# EAGLE design footwell_tiny (EAGLE 9.6.0)
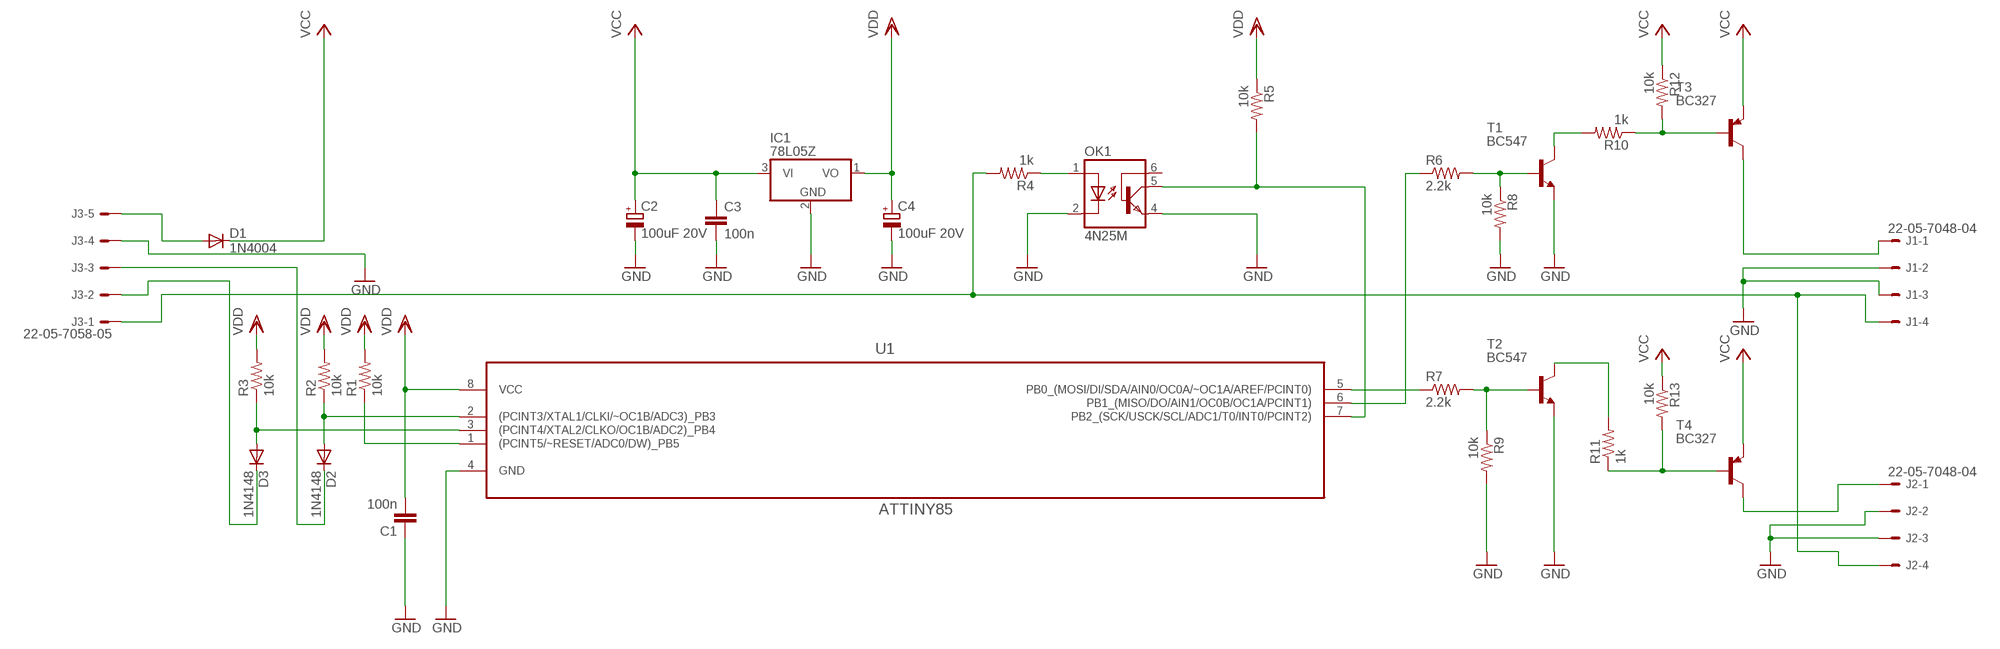
[diagram p0: schematic, sheet 1]

## Parts
C1  100n  C-EU025-025X050  [C025-025X050]
C2  100uF 20V  CPOL-EUE3.5-8  [E3,5-8]
C3  100n  C-EU025-025X050  [C025-025X050]
C4  100uF 20V  CPOL-EUE3.5-8  [E3,5-8]
D1  1N4004  [DO41-10]
D2  1N4148  [DO35-10]
D3  1N4148  [DO35-10]
IC1  78L05Z  [TO92]
J1  22-05-7048-04  [7395-04]
J2  22-05-7048-04  [7395-04]
J3  22-05-7058-05  [7395-05]
OK1  4N25M  [DIL06]
R1  10k  R-US_0207/10  [0207/10]
R2  10k  R-US_0207/10  [0207/10]
R3  10k  R-US_0207/10  [0207/10]
R4  1k  R-US_0207/10  [0207/10]
R5  10k  R-US_0207/10  [0207/10]
R6  2.2k  R-US_0207/10  [0207/10]
R7  2.2k  R-US_0207/10  [0207/10]
R8  10k  R-US_0207/10  [0207/10]
R9  10k  R-US_0207/10  [0207/10]
R10  1k  R-US_0207/10  [0207/10]
R11  1k  R-US_0207/10  [0207/10]
R12  10k  R-US_0207/10  [0207/10]
R13  10k  R-US_0207/10  [0207/10]
T1  BC547  BC547-NPN-TO92-CBE  [TO92-CBE]
T2  BC547  BC547-NPN-TO92-CBE  [TO92-CBE]
T3  BC327  BC327-25  [TO92-EBC]
T4  BC327  BC327-25  [TO92-EBC]
U1  ATTINY85  ATTINY85-20PU  [DIP254P762X533-8]

## Nets
DOOR0: D2.C J3.3
DOOR1: D3.C J3.2
GND: C1.1 C2.- C3.2 C4.- IC1.2(GND) J1.2 J1.3 J2.2 J2.3 J3.4 OK1.2(C) OK1.4(EMI) R8.2 R9.2 T1.E T2.E U1.4(GND)
N$2: R1.1 U1.1((PCINT5/~RESET/ADC0/DW)_PB5)
N$3: R10.1 R12.2 T3.B
N$4: R10.2 T1.C
N$5: R6.2 R8.1 T1.B
N$6: R11.1 R13.2 T4.B
N$7: R11.2 T2.C
N$8: R7.2 R9.1 T2.B
N$9: R6.1 U1.6(PB1_(MISO/DO/AIN1/OC0B/OC1A/PCINT1))
N$10: R7.1 U1.5(PB0_(MOSI/DI/SDA/AIN0/OC0A/~OC1A/AREF/PCINT0))
N$11: OK1.1(A) R4.1
N$12: OK1.5(COL) R5.2 U1.7(PB2_(SCK/USCK/SCL/ADC1/T0/INT0/PCINT2))
N$16: J1.4 J2.4 J3.1 R4.2
N$18: J2.1 T4.C
N$19: J1.1 T3.C
N$20: D1.A J3.5
PB3: D2.A R2.1 U1.2((PCINT3/XTAL1/CLKI/~OC1B/ADC3)_PB3)
PB4: D3.A R3.1 U1.3((PCINT4/XTAL2/CLKO/OC1B/ADC2)_PB4)
VCC: C2.+ C3.1 D1.C IC1.3(VI) R12.1 R13.1 T3.E T4.E
VDD: C1.2 C4.+ IC1.1(VO) R1.2 R2.2 R3.2 R5.1 U1.8(VCC)
Unconnected: OK1.6(BAS)

## Library data of the parts
C1 C3 = rcl:C-EU: CAPACITOR, European symbol
C2 C4 = rcl:CPOL-EU: POLARIZED CAPACITOR, European symbol
D1 = adafruit:1N4004: DIODE General purpose 1N400x type rectifier (With bigger pads) http://www.ladyada.net/library/pcb/eaglelibrary.html
D2 D3 = diode-1:1N4148: DIODE high speed (Philips)
IC1 = linear:78*: Positive VOLTAGE REGULATOR Source: http://cache.national.com/ds/LM/LM78L05.pdf http://www.fairchildsemi.com/ds/LM/LM7805.pdf
J1 J2 = con-molex:22-?-04: CONNECTOR wire to board 2.54 mm (.1 inch) pitch header
J3 = con-molex:22-?-05: CONNECTOR wire to board 2.54 mm (.1 inch) pitch header
OK1 = optocoupler:4N*?M: General Purpose 6-Pin Phototransistor Optocouplers Source: http://www.fairchildsemi.com/ds/4N/4N35-M.pdf; MPN: 4N25-M; OC_FARNELL: 1021349; OC_NEWARK: 98K9084
R1-R13 = adafruit:R-US_: RESISTOR, American symbol
T1 T2 = transistor:*-NPN-: NPN Transistror BF959 corrected 2008.03.06
T3 T4 = transistor-pnp:BC327*: PNP Transistror
U1 = Atmel_By_element14_Batch_1-00:ATTINY85-20PU: 8-bit Microcontroller with In-System Programmable Flash; MPN: ATTINY85-20PU; OC_FARNELL: 1455162; OC_NEWARK: 58M3796; PACKAGE: PDIP-8; SUPPLIER: Atmel

## Net classes
0 default: clearance 0.205 mm

## Board
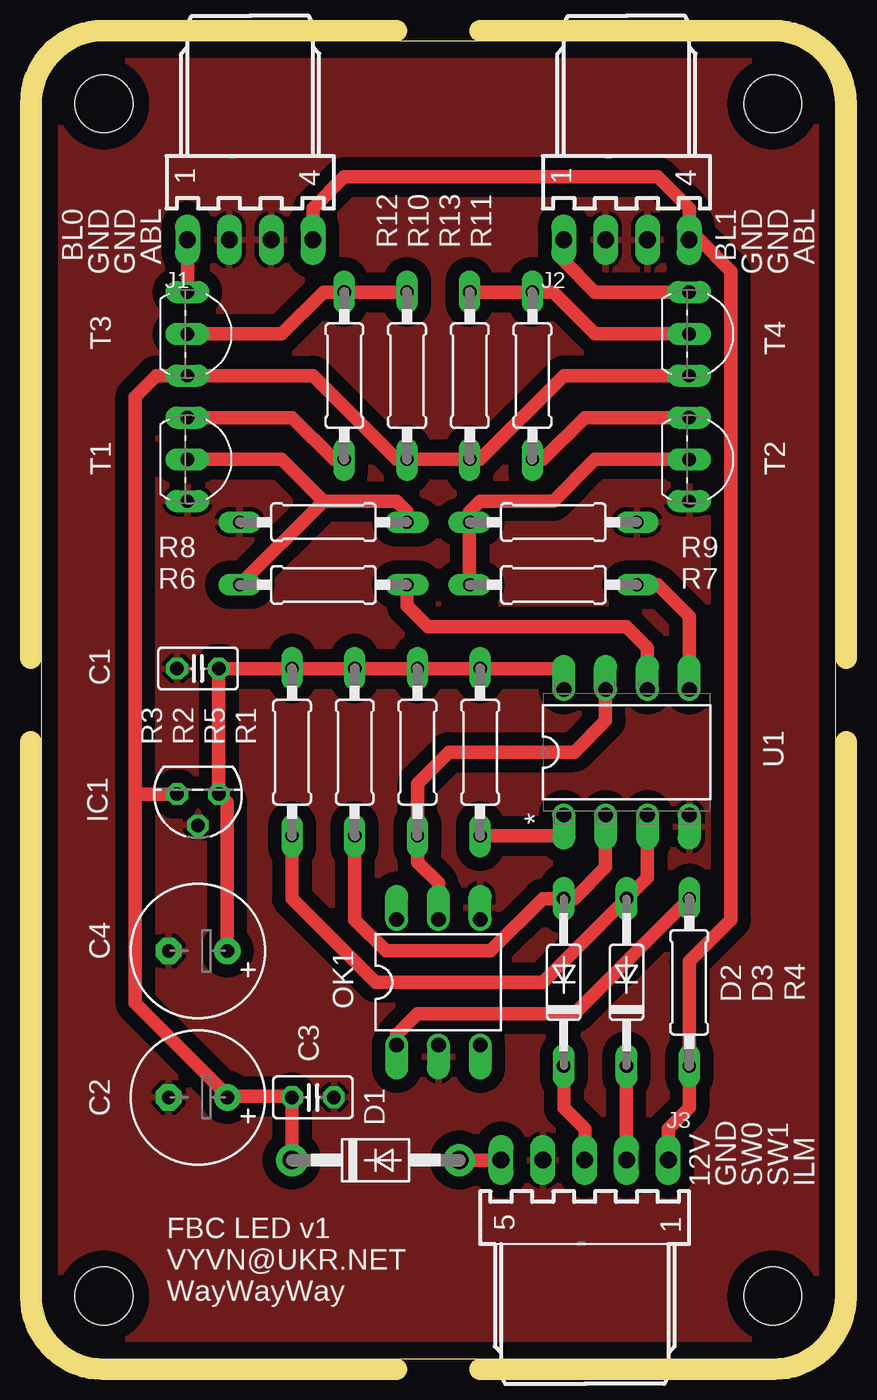
[diagram p1: board, top side]
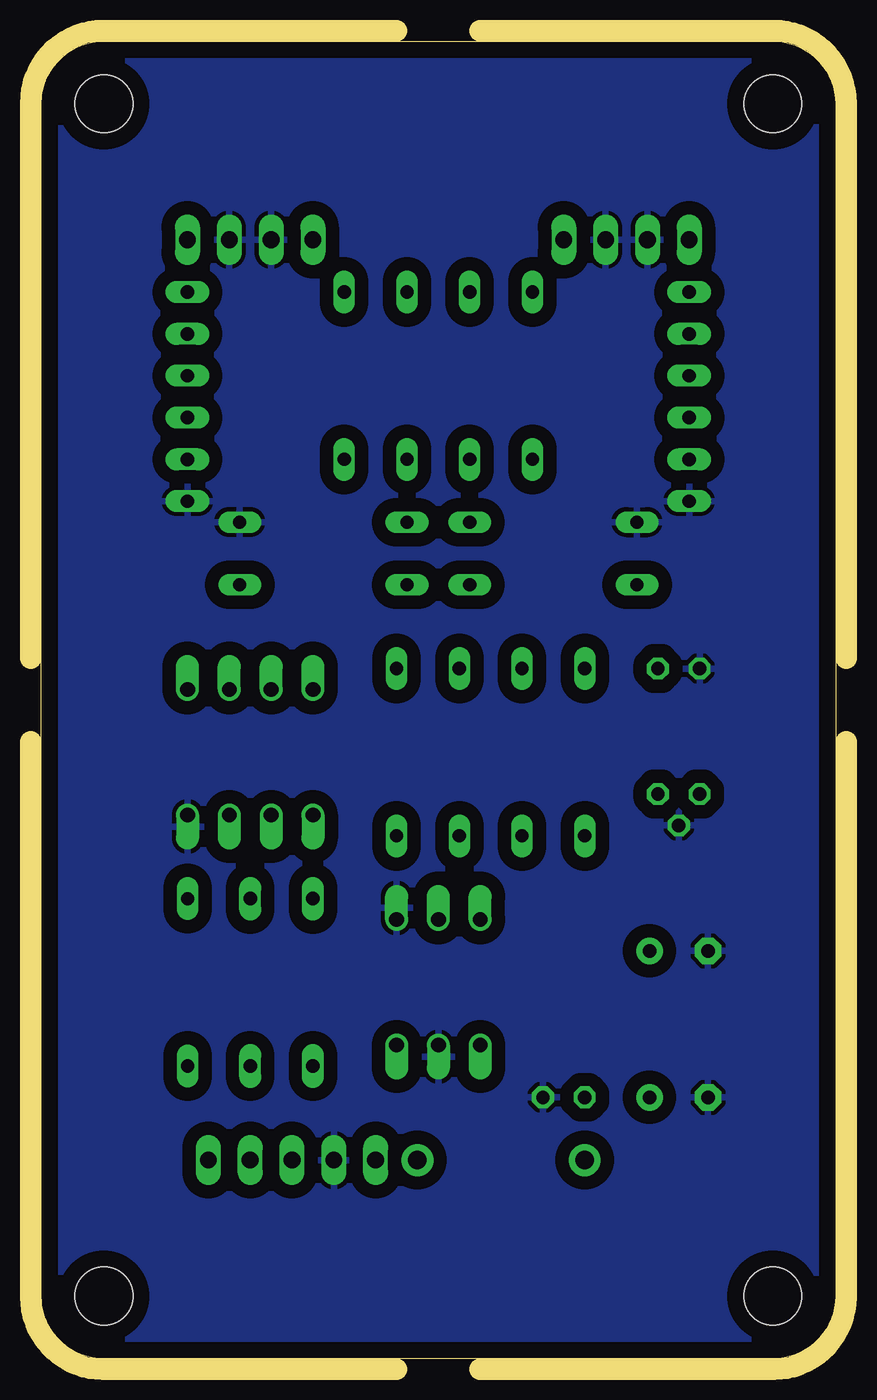
[diagram p2: board, bottom side, seen from below]

Size 48.26 x 80 mm. Coordinates in mm from the lower left corner, seen from the top.
Outline: 0,76.19 0,3.81 arc90 3.81,0 44.45,0 arc90 48.26,3.81 48.26,76.19 arc90 44.45,80 3.81,80 arc90 0,76.19
Copper layers (1*16): Top 0.035mm / dielectric 1.5mm / Bottom 0.035mm
Design rules "default": minimum track width 10mil, minimum drill 24mil, track to track 8mil, track to pad 8mil, pad to pad 8mil, via to via 8mil, smd to smd 8mil, copper to edge 40mil, drill to drill 8mil, minimum pad ring 10mil, minimum via ring 8mil, stop-mask expansion 4mil, vias tented up to drill 0mil, thermal gap 10mil
Holes 3.5 mm at 3.81,3.81 44.45,3.81 44.45,76.2 3.81,76.2
Milling: 12 lines

### Footprints (pad centres in the part's own frame; a part is rotated, then mirrored left to right if it is on the bottom)
C025-025X050 = drill 0.813 octagon: 1 -1.27,0; 2 1.27,0
E3,5-8 = drill 0.813 pad 1.6: + -1.778,0 | drill 0.813 pad 1.6 octagon: - 1.778,0
DO41-10 = drill 1.118 pad 1.93: A 5.08,0; C -5.08,0
DO35-10 = drill 0.813 long: A 5.08,0; C -5.08,0
TO92 = drill 0.813 octagon: 1 -1.27,0; 2 0,1.905; 3 1.27,0
7395-04 = drill 1.016 long: 1 3.81,0; 2 1.27,0; 3 -1.27,0; 4 -3.81,0
7395-05 = drill 1.016 long: 1 5.08,0; 2 2.54,0; 3 0,0; 4 -2.54,0; 5 -5.08,0
DIL06 = drill 0.9 offset: 1 -2.54,-3.81; 2 0,-3.81; 3 2.54,-3.81; 4 2.54,3.81; 5 0,3.81; 6 -2.54,3.81
0207/10 = drill 0.8 long: 1 -5.08,0; 2 5.08,0
TO92-CBE = drill 0.813 long: B 0,0; C -2.54,0; E 2.54,0
TO92-EBC = drill 0.813 long: B 0,-1.27; C -2.54,-1.27; E 2.54,-1.27
DIP254P762X533-8 = drill 0.9 offset: 1 -7.62,7.62; 2 -7.62,5.08; 3 -7.62,2.54; 4 -7.62,0; 5 0,0; 6 0,2.54; 7 0,5.08; 8 0,7.62

### Placement (x,y rotation side)
C1  9.53,41.91 0 top
C2  9.53,15.88 180 top
C3  16.51,15.88 0 top
C4  9.53,24.77 180 top
D1  20.32,12.07 0 top
D2  31.75,22.86 90 top
D3  35.56,22.86 90 top
IC1  9.53,34.29 180 top
J1  12.7,67.95 180 top
J2  35.56,67.95 180 top
J3  33.02,12.07 0 top
OK1  24.13,22.86 0 top
R1  26.67,36.83 90 top
R2  19.05,36.83 90 top
R3  15.24,36.83 90 top
R4  39.37,22.86 270 top
R5  22.86,36.83 270 top
R6  17.14,46.99 180 top
R7  31.11,46.99 180 top
R8  17.14,50.8 180 top
R9  31.11,50.8 0 top
R10  18.41,59.69 270 top
R11  29.84,59.69 270 top
R12  22.23,59.69 90 top
R13  26.04,59.69 90 top
T1  8.89,54.61 270 top
T2  39.37,54.61 270 top
T3  10.16,62.23 270 top
T4  40.64,62.23 270 top
U1  39.37,40.64 90 top

### Tracks (layer width: path | path; a pad name or v marks a point on that pad's centre or on a via)
DOOR0
  Top 0.813: J3.3 33.02,13.97 31.75,15.24 D2.C
DOOR1
  Top 0.813: J3.2 D3.C
GND
  pour Bottom (isolate 0.813): -1.27,81.28 -1.27,-1.27 49.53,-1.27 49.53,81.28
  pour Top (isolate 0.813): 44.45,0 3.81,0 arc-90 0,3.81 0,76.2 arc-90 3.81,80.01 44.45,80.01 arc-90 48.26,76.2 48.26,3.81 arc-90
N$2
  Top 0.813: R1.1 31.75,31.75 U1.1
N$3
  Top 0.813: R12.2 R10.1 17.14,64.77 14.61,62.23 T3.B
N$4
  Top 0.813: T1.C 15.24,57.15 17.78,54.61 R10.2
N$5
  Top 0.813: T1.B 14.61,54.61 17.14,52.07 | 17.14,52.07 21.59,52.07 22.23,51.43 R8.1 | 17.14,52.07 R6.2
N$6
  Top 0.813: R13.2 R11.1 31.11,64.77 33.65,62.23 T4.B
N$7
  Top 0.813: T2.C 33.02,57.15 30.48,54.61 R11.2
N$8
  Top 0.813: R7.2 R9.1 26.04,51.43 26.67,52.07 31.11,52.07 33.65,54.61 T2.B
N$9
  Top 0.813: U1.6 36.83,43.18 35.56,44.45 23.5,44.45 22.23,45.72 R6.1
N$10
  Top 0.813: U1.5 39.37,45.08 37.46,46.99 R7.1
N$11
  Top 0.813: OK1.1 21.59,19.68 22.86,20.96 32.38,20.96 R4.1
N$12
  Top 0.813: U1.7 34.29,38.73 32.38,36.83 24.77,36.83 22.86,34.92 R5.2 22.86,30.16 24.13,28.89 OK1.5
N$16
  Top 0.813: J3.1 38.1,13.97 39.37,15.24 R4.2 39.37,24.13 41.91,26.67 41.91,66.04 40,67.95 J2.4 39.37,69.85 37.46,71.76 18.41,71.76 16.51,69.85 J1.4
N$18
  Top 0.813: J2.1 31.75,66.67 33.65,64.77 T4.C
N$19
  Top 0.813: T3.C J1.1
N$20
  Top 0.813: D1.A J3.5
PB3
  Top 0.813: R2.1 19.05,26.67 20.96,24.77 27.3,24.77 30.48,27.94 D2.A 32.38,27.94 34.29,29.84 U1.2
PB4
  Top 0.813: U1.3 36.83,29.21 D3.A 30.48,22.86 20.32,22.86 15.24,27.94 R3.1
VCC
  Top 0.254: 15.02,15.94 C3.1 | 15.25,12.27 D1.C | C2.+ 11.35,15.94 11.36,15.95
  Top 0.813: T4.E 31.75,59.69 26.67,54.61 R13.1 R12.1 21.59,54.61 16.51,59.69 T3.E 6.99,59.69 5.71,58.42 5.71,34.29 | 5.71,34.29 5.71,21.59 11.36,15.95 11.43,15.88 | IC1.3 5.71,34.29 | 15.02,15.94 11.81,15.94 C2.+ | 15.25,12.27 15.25,15.71 C3.1
VDD
  Top 0.813: U1.8 31.75,41.91 R1.2 R5.1 R2.2 R3.2 C1.2 IC1.1 11.3,33.78 C4.+

### Text on the board
tNames: BL0 | GND | GND | ABL | BL1 | GND | GND | ABL | 12V | GND | SW0 | SW1 | ILM | FBC LED v1 / VYVN@UKR.NET | WayWayWay